# EAGLE schematic electro (EAGLE 7.2.0)
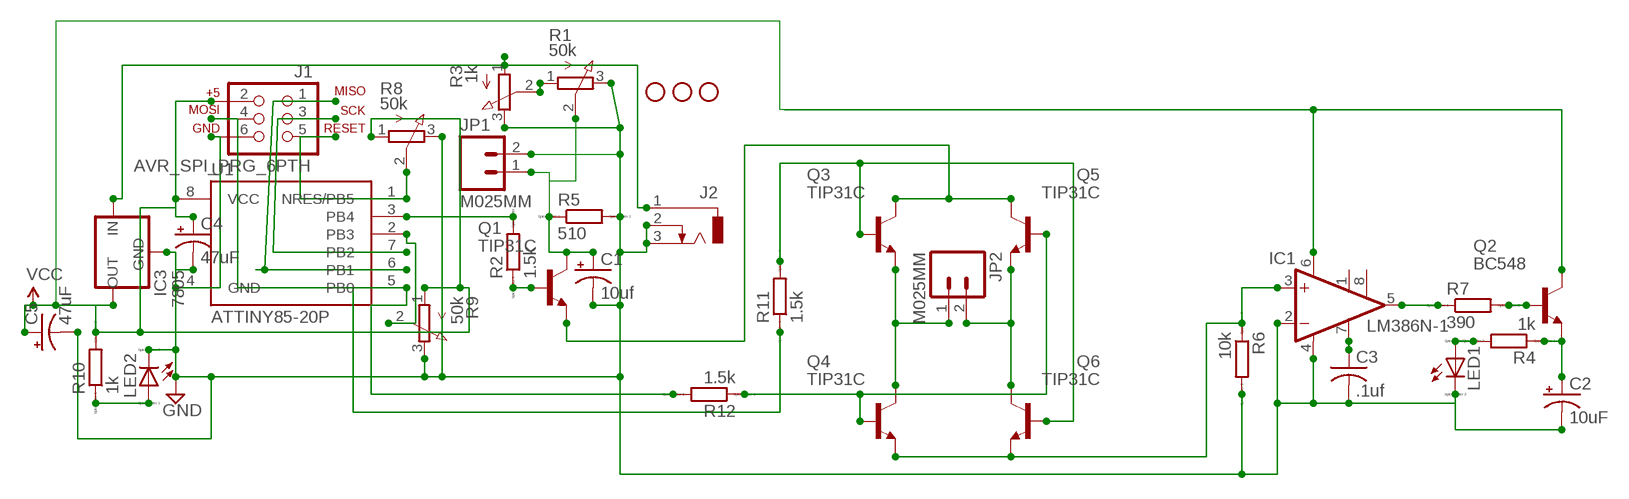
[diagram p0: schematic, sheet 1]

## Parts
C1  10uf  CPOL-USE2,5-6E  [E2,5-6E]
C2  10uF  CPOL-USE2,5-6E  [E2,5-6E]
C3  .1uf  C-US025-025X050  [C025-025X050]
C4  47uF  CPOL-USE2.5-6  [E2,5-6]
C5  47uF  CPOL-USE2.5-6  [E2,5-6]
IC1  LM386N-1  [DIL08]
IC3  7805  78XXL  [78XXL]
J1  AVR_SPI_PRG_6PTH  [2X3]
J2  DCJ0303  [DCJ0303]
JP1  M025MM  [SCREWTERMINAL-5MM-2]
JP2  M025MM  [SCREWTERMINAL-5MM-2]
LED1  LED_ELD260  [LED_LD260]
LED2  LED_ELD260  [LED_LD260]
Q1  TIP31C  [TO220]
Q2  BC548  [TO92-EBC]
Q3  TIP31C  [TO220]
Q4  TIP31C  [TO220]
Q5  TIP31C  [TO220]
Q6  TIP31C  [TO220]
R1  50k  3RP/1610N  [3RP/1610N]
R2  1.5k  R0207/10  [0207/10]
R3  1k  3RP/1610N  [3RP/1610N]
R4  1k  R0207/10  [0207/10]
R5  510  R0207/10  [0207/10]
R6  10k  R0207/10  [0207/10]
R7  390  R0207/10  [0207/10]
R8  50k  3RP/1610N  [3RP/1610N]
R9  50k  3RP/1610N  [3RP/1610N]
R10  1k  R0207/10  [0207/10]
R11  1.5k  R0207/10  [0207/10]
R12  1.5k  R0207/10  [0207/10]
STANDOFF2  STAND-OFF  [STAND-OFF]
STANDOFF3  STAND-OFF  [STAND-OFF]
STANDOFF4  STAND-OFF  [STAND-OFF]
U1  ATTINY85-20P  [PDIP08_300MIL]

## Nets
GND: C1.- C2.- C3.2 C4.- C5.- IC1.2(-IN) IC1.4(GND) IC3.GND J1.6 J2.2 J2.3 JP1.2 LED1.K(C) LED2.K(C) R1.3(E) R3.3(E) R5.2 R6.2 R8.3(E) R9.3(E) U1.4(GND)
N$1: R1.1(A) R3.2(S)
N$2: IC3.IN J2.1 R3.1(A)
N$3: R9.2(S) U1.2(PB3)
N$4: C2.+ Q2.E R4.1
N$5: R2.2 U1.3(PB4)
N$6: Q1.1(B) R2.1
N$7: J1.5 R8.2(S) U1.1(NRES/PB5)
N$8: C1.+ JP1.1 Q1.2(C) R1.2(S) R5.1
N$9: Q3.1(B) Q6.1(B) R11.2
N$10: J1.1 U1.6(PB1)
N$11: JP2.1 Q3.3(E) Q4.2(C)
N$12: IC1.5(OUT) R7.1
N$13: JP2.2 Q5.3(E) Q6.2(C)
N$14: C3.1 IC1.7(BYPASS)
N$15: Q2.B R7.2
N$16: J1.3 U1.7(PB2)
N$17: Q4.1(B) Q5.1(B) R12.1
N$19: Q1.3(E) Q3.2(C) Q5.2(C)
N$20: J1.4 R11.1 R12.2 U1.5(PB0)
N$21: LED1.A R4.2
N$24: LED2.A R10.1
N$26: IC1.3(+IN) Q4.3(E) Q6.3(E) R6.1
VCC: C4.+ C5.+ IC1.6(VS) IC3.OUT J1.2 Q2.C R8.1(A) R9.1(A) R10.2 U1.8(VCC)
Unconnected: IC1.1(GAIN) IC1.8(GAIN)

## Library data of the parts
C1 C2 C4 C5 = rcl:CPOL-US: POLARIZED CAPACITOR, American symbol
C3 = rcl:C-US: CAPACITOR, American symbol
IC1 = linear:LM386?-*: Low Voltage Audio Power Amplifier Source: http://cache.national.com/ds/LM/LM386.pdf
IC3 = v-reg:78XXL: VOLTAGE REGULATOR
J1 = SparkFun-Connectors:AVR_SPI_PRG_6: AVR ISP 6 Pin This is the reduced ISP connector for AVR programming. Common on Arduino. This footprint will take up less PCB space and can be used with a 10-pin to 6-pin adapter such as SKU: BOB-08508 **Special note about "TEST_POINT" package. The stop mask is on the top side, so if you want your programming test points to be on the bottom of your board, make sure to place this package on the bottom side of the board. This also ensure that the orientation to program from the bottom side will be correct.
J2 = con-jack:DCJ0303: DC POWER JACK Source: DCJ0303.pdf; OC_FARNELL: unknown; OC_NEWARK: unknown
JP1 JP2 = SparkFun-Connectors:M02: Standard 2-pin 0.1" header. Use with - straight break away headers ( PRT-00116) - right angle break away headers (PRT-00553) - swiss pins (PRT-00743) - machine pins (PRT-00117) - female headers (PRT-00115) Molex polarized connector foot print use with: PRT-08233 with associated crimp pins and housings. 2.54_SCREWTERM for use with PRT-10571. 3.5mm Screw Terminal footprints for PRT-08084 5mm Screw Terminal footprints for use with PRT-08433
LED1 LED2 = eagle-ltspice:LED_E: LED Source: http://www.osram.convergy.de Source: www.luxeon.com Source: www.kingbright.com; SPICEMODEL: NONE; SPICEPREFIX: D; SPICETYPE: diode
Q1 Q3-Q6 = transistor-npn:TIP31C*: NPN Transistor
Q2 = transistor-npn:BC548*: NPN Transistor
R1 R3 R8 R9 = pot:3RP/1610N: 16mm Potentiometer one level Source: http://www.alphapotentiometers.net/html/16mm_pot_2.html
R2 R4-R7 R10-R12 = eagle-ltspice:R: RESISTOR, European symbol; SPICEMODEL: NONE; SPICEPREFIX: R
STANDOFF2-STANDOFF4 = SparkFun-Electromechanical:STAND-OFF: #4 Stand Off This is the mechanical footprint for a #4 phillips button head screw. Use the keepout ring to avoid running the screw head into surrounding components. SKU : PRT-00447
U1 = _hhn_attiny25_45_85:ATTINY85*: ATMEL ATtiny 85 Packages: P = PDIP 08 30mil S = SOIC 08 EIAJ 208mil Technologies Note: for complete ordering code (temp. range, finish, tape&reel etc.) see www.atmel.com • Supply Voltage: V = (1.8…5.5)V | [blank] = (2.7…5.5)V • Speed: 10 = 10 MHz | 20 = 20 MHz Author: Dipl.-Ing. FH Rainer Bayer HHN Hochschule Heilbronn (Heilbronn University), rainer.bayer@hs-heilbronn.de Ingenieurbüro ing-rb, mail@ing-rb.de